# EAGLE design 5v AC-DC REGULATOR (EAGLE 9.6.2)
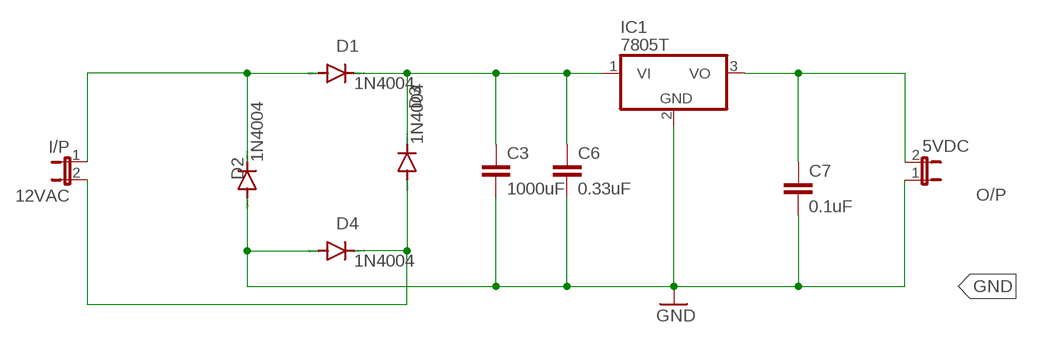
[diagram p0: schematic, sheet 1]

## Parts
C3  1000uF  C2,5-3  [C2.5-3]
C6  0.33uF  C2,5-3  [C2.5-3]
C7  0.1uF  C2,5-3  [C2.5-3]
D1  1N4004  [DO41-10]
D2  1N4004  [DO41-10]
D3  1N4004  [DO41-10]
D4  1N4004  [DO41-10]
I/P  12VAC  JP1E  [JP1]
IC1  7805T  [TO220H]
O/P  5VDC  JP1E  [JP1]

## Nets
GND: C3.2 C6.2 C7.2 D2.A D4.A IC1.2(GND) O/P.1
N$1: C3.1 C6.1 D1.C D3.C IC1.1(VI)
N$3: D3.A D4.C I/P.2
N$4: D1.A D2.C I/P.1
N$7: C7.1 IC1.3(VO) O/P.2

## Library data of the parts
C3 C6 C7 = capacitor-wima:C: CAPACITOR naming: grid - package width
D1-D4 = diode:1N4004: DIODE general purpose rectifier, 1 A
I/P O/P = jumper:JP1E: JUMPER
IC1 = linear:78*: Positive VOLTAGE REGULATOR Source: http://cache.national.com/ds/LM/LM78L05.pdf http://www.fairchildsemi.com/ds/LM/LM7805.pdf

## Board
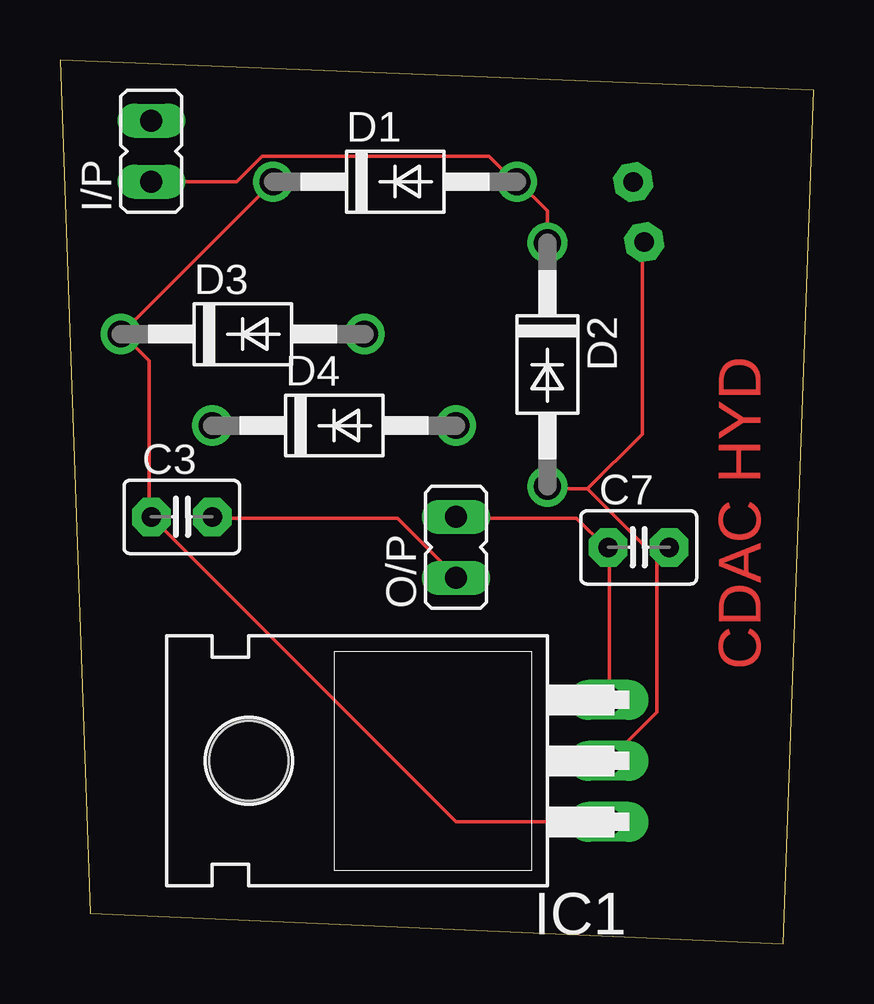
[diagram p1: board, top side]
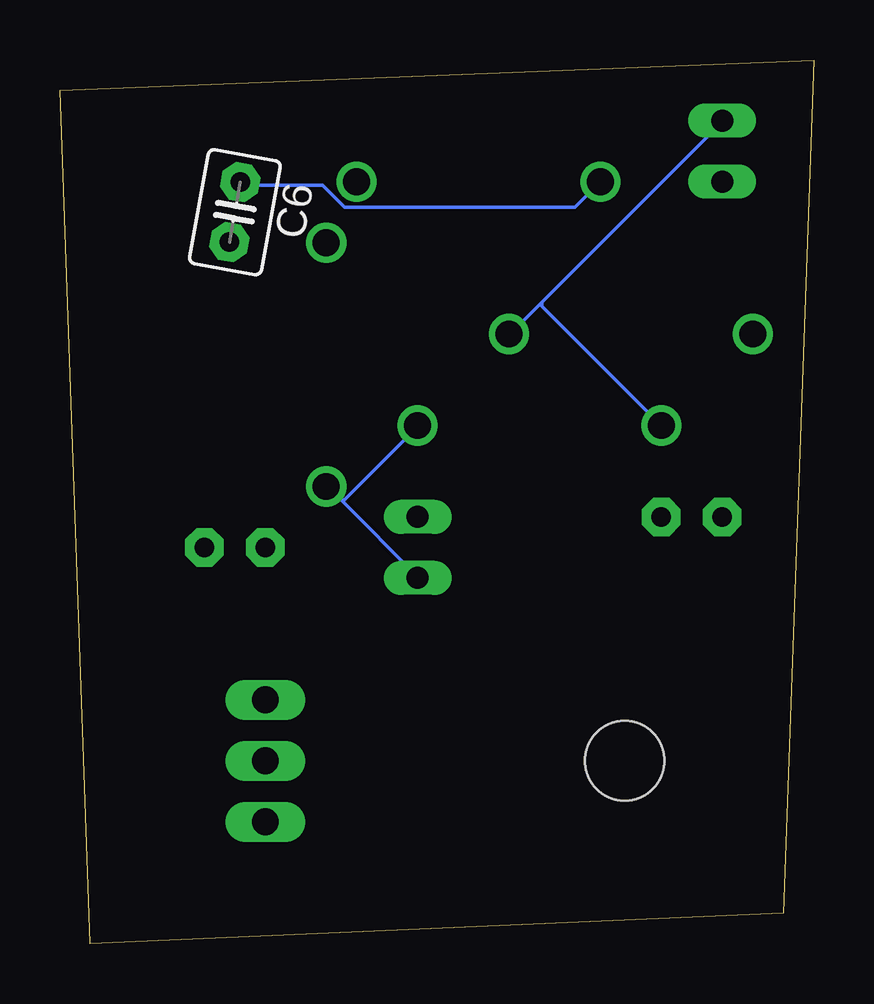
[diagram p2: board, bottom side, seen from below]

Size 31.42 x 36.82 mm. Coordinates in mm from the lower left corner, seen from the top.
Outline: 1.27,1.27 30.15,0 31.42,35.55 0,36.82 1.27,1.27
Copper layers (1*16): Top 0.035mm / dielectric 1.5mm / Bottom 0.035mm
Design rules "default": minimum track width 6mil, minimum drill 0.35mm, track to track 6mil, track to pad 6mil, pad to pad 6mil, via to via 6mil, smd to smd 6mil, copper to edge 40mil, drill to drill 6mil, minimum pad ring 10mil, minimum via ring 8mil, stop-mask expansion 4mil, vias tented up to drill 0mil, thermal gap 10mil

### Footprints (pad centres in the part's own frame; a part is rotated, then mirrored left to right if it is on the bottom)
C2.5-3 = drill 0.813 pad 1.6 octagon: 1 -1.27,0; 2 1.27,0
DO41-10 = drill 1.118: A 5.08,0; C -5.08,0
JP1 = drill 0.914 long: 1 0,-1.27; 2 0,1.27
TO220H = drill 1.118 long: 1 -2.54,-10.16; 2 0,-10.16; 3 2.54,-10.16 | hole 3.302: 0,4.826

### Placement (x,y rotation side)
C3  5.08,17.78 0 top
C6  24.13,30.48 259.7 bottom
C7  24.13,16.51 0 top
D1  13.97,31.75 0 top
D2  20.32,24.13 270 top
D3  7.62,25.4 0 top
D4  11.43,21.59 0 top
I/P  3.81,33.02 0 top
IC1  12.7,7.62 90 top
O/P  16.51,16.51 0 top

### Tracks (layer width: path | path; a pad name or v marks a point on that pad's centre or on a via)
GND
  Top 0.152: 24.89,16.51 24.43,16.51 22,18.95 | 24.89,16.51 C7.2 25.35,16.51 | 22,18.95 20.32,18.95 D2.A | C3.2 6.45,17.73 14.07,17.73 16.51,15.29 O/P.1 | 22,18.95 24.28,21.23 24.28,29.16 C6.2 | IC1.2 24.89,9.65 24.89,16.51
  Bottom 0.152: 19.71,18.49 20.32,19.1 D2.A 19.71,18.49 | 19.71,18.49 16.51,15.29 O/P.1 | 19.71,18.49 19.56,18.49 16.51,21.54 D4.A
  cutout Top (no thermals): -2.54,38.1 33.02,38.1 34.29,36.83 34.29,-1.27 33.02,-2.54 -1.27,-2.54 -2.54,-1.27
  cutout Bottom (no thermals): -3.81,39.37 35.56,39.37 35.56,-2.54 36.83,-3.81 -3.81,-3.81
N$1
  Top 0.152: IC1.1 16.51,5.08 C3.1 3.71,17.88 3.71,24.28 2.64,25.35 D3.C D1.C
  Bottom 0.152: D1.C 9.96,30.68 19.56,30.68 20.47,31.6 23.82,31.6 C6.1
N$3
  Bottom 0.152: 11.33,26.72 12.7,25.35 D3.A | 11.33,26.72 3.86,34.19 I/P.2 | D4.C 11.33,26.57 11.33,26.72
N$4
  Top 0.152: I/P.1 7.37,31.75 8.43,32.82 17.88,32.82 18.95,31.75 D1.A 19.1,31.75 20.32,30.53 D2.C
N$7
  Top 0.152: O/P.2 16.51,17.73 21.54,17.73 22.76,16.51 C7.1 22.91,16.51 22.91,10.26 IC1.3

### Text on the board
Top: CDAC HYD | CDAC HYD